# EAGLE design osZ_inv (EAGLE 5.10)
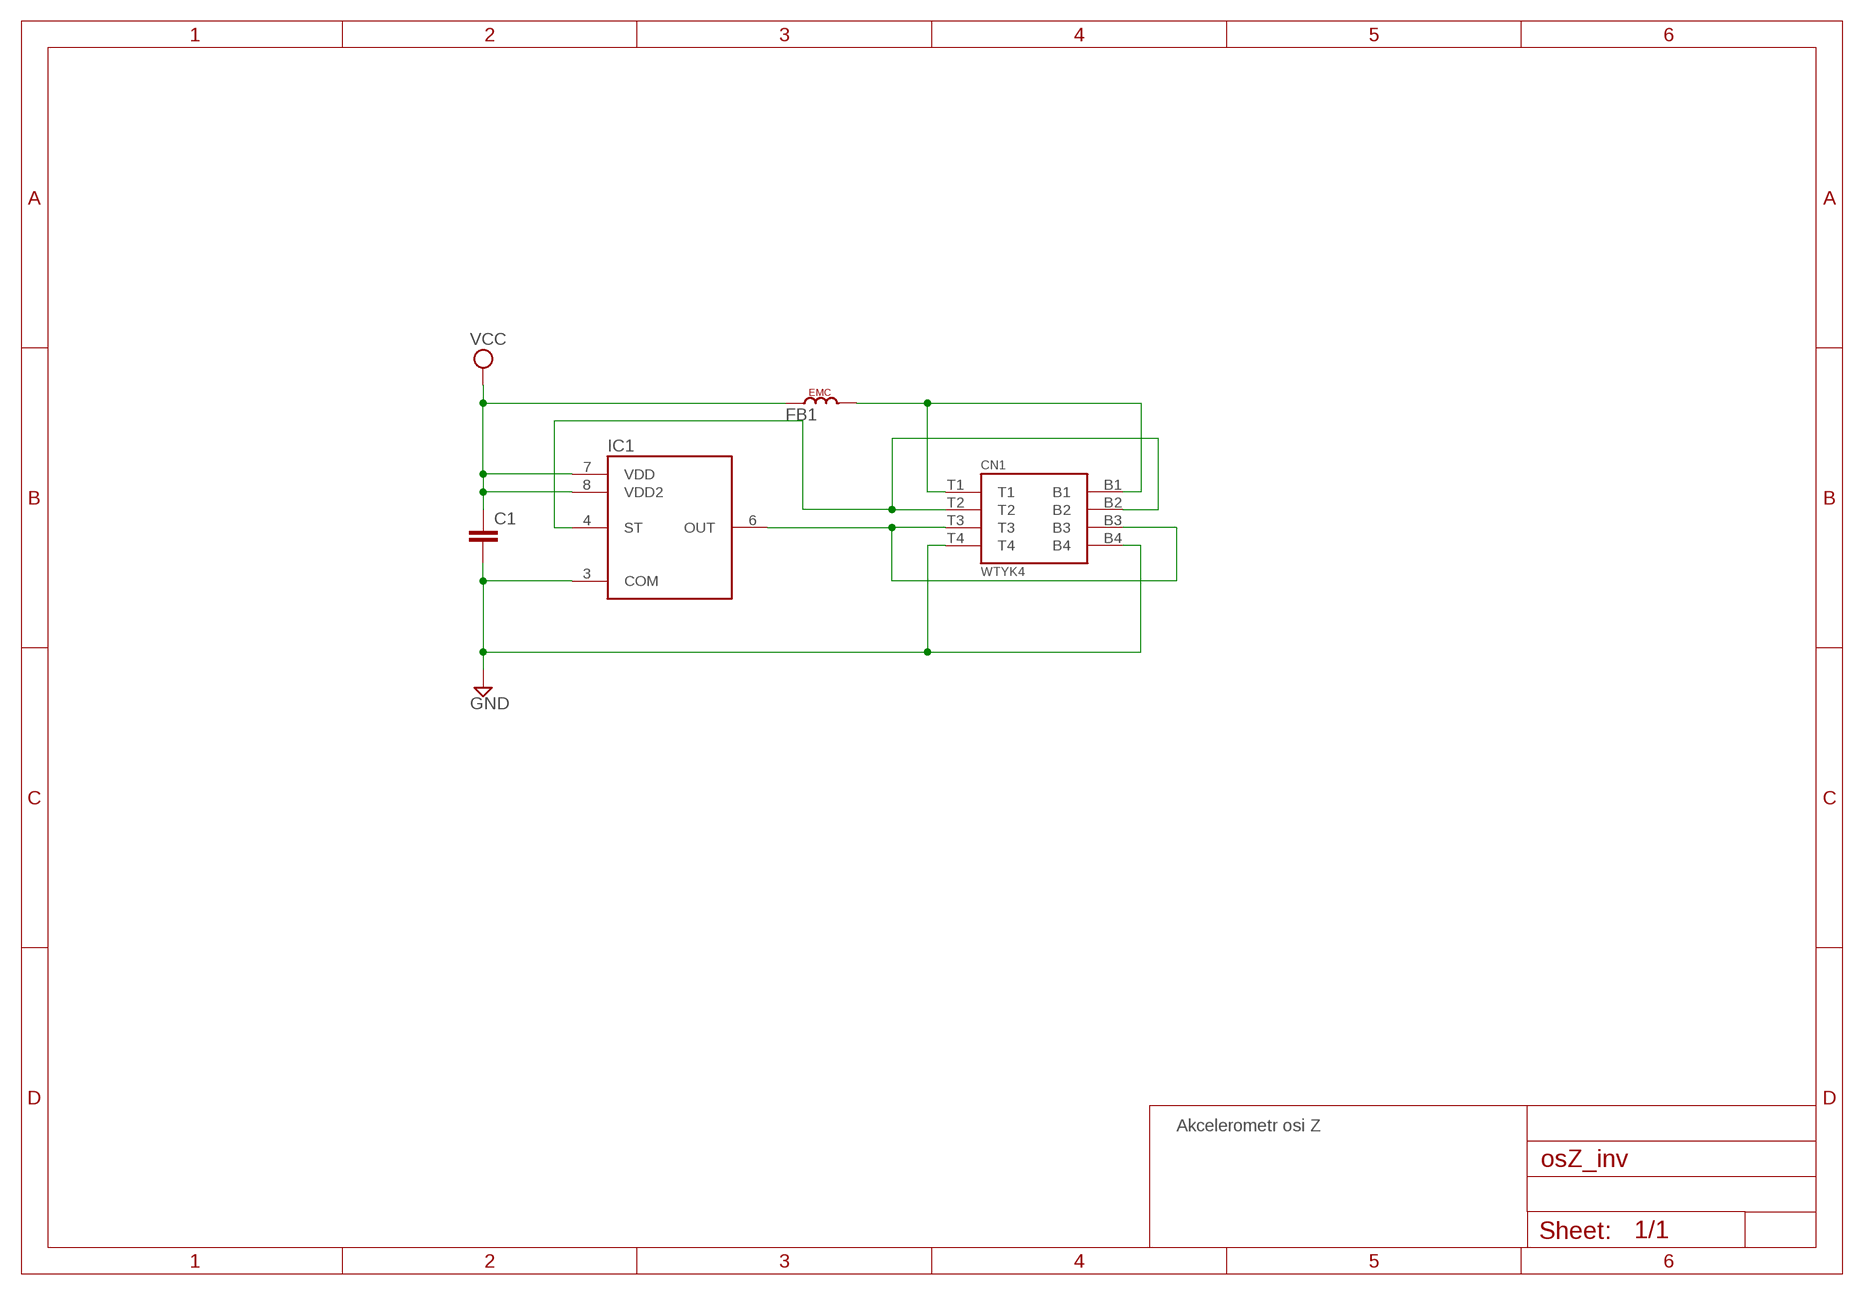
[diagram p0: schematic, sheet 1]

## Parts
C1  C-EUC0805K  [C0805K]
CN1  WTYK4  [WTYK]
FB1  FERRITE_BEAD0805  [R0805]
IC1  ADXL001-70L  [LCC8_LONG]

## Nets
GND: C1.2 CN1.B4 CN1.T4 IC1.3(COM)
N$1: CN1.B1 CN1.T1 FB1.2
N$6: CN1.B2 CN1.T2 IC1.4(ST)
N$8: CN1.B3 CN1.T3 IC1.6(OUT)
VCC: C1.1 FB1.1 IC1.7(VDD) IC1.8(VDD2)

## Notes on the sheet
- Akcelerometr osi Z

## Library data of the parts
C1 = rcl:C-EU: CAPACITOR, European symbol
CN1 = mechanika:WTYK4
FB1 = passives:FERRITE_BEAD
IC1 = lib1:ADXL001

## Board
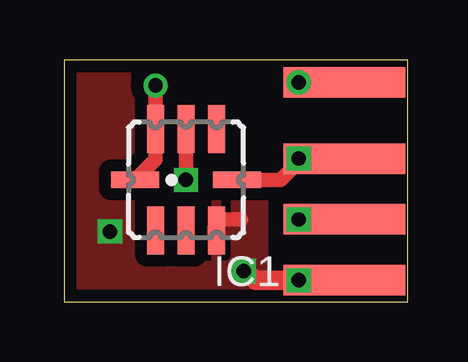
[diagram p1: board, top side]
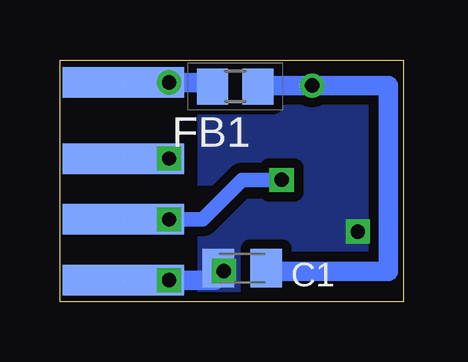
[diagram p2: board, bottom side, seen from below]

Size 14.33 x 10.08 mm. Coordinates in mm from the lower left corner, seen from the top.
Outline: 0,0 14.33,0 14.33,10.08 0,10.08 0,0
Copper layers (1*16): Top 0.035mm / dielectric 1.5mm / Bottom 0.035mm
Design rules "drukowane.pl *": minimum track width 8mil, minimum drill 16mil, track to track 8mil, track to pad 8mil, pad to pad 8mil, via to via 8mil, smd to smd 8mil, copper to edge 16mil, drill to drill 8mil, minimum pad ring 10mil, minimum via ring 8mil, stop-mask expansion 4mil, vias tented up to drill 0mil, thermal gap 10mil
tRestrict: area 9,-0.3 to 14.4,9.5
bRestrict: area 9,-0.1 to 14.4,9.5

### Footprints (pad centres in the part's own frame; a part is rotated, then mirrored left to right if it is on the bottom)
C0805K = smd 1.3 x 1.6: 1 -1,0; 2 1,0
WTYK = smd 5.08 x 1.27 bottom: B1 0,4.445; B2 0,1.27; B3 0,-1.27; B4 0,-3.81 | smd 5.08 x 1.27: T1 0,4.445; T2 0,1.27; T3 0,-1.27; T4 0,-3.81
R0805 = smd 1.3 x 1.5: 1 -0.95,0; 2 0.95,0
LCC8_LONG = smd 2 x 0.7: 1 -2.121,1.27; 2 -2.121,0; 3 -2.121,-1.27; 5 2.121,-1.27; 6 2.121,0; 7 2.121,1.27 | smd 0.7 x 2: 4 0,-2.121; 8 0,2.121

### Placement (x,y rotation side)
C1  6.73,1.4 180 bottom
CN1  11.68,4.7 0 top
FB1  7.02,8.98 180 bottom
IC1  5.08,5.08 90 top

### Tracks (layer width: path | path; a pad name or v marks a point on that pad's centre or on a via)
GND  (via drill 0.6)  (1 unrouted)
  Top 0.61: 6.6,3.43 7.37,3.43
  Top 0.813: v9.78,0.89 8,0.89 v7.49,1.27
  Bottom 0.813: v9.78,0.89 CN1.T4 7.87,0.89 v7.49,1.27
  other vias: 1.91,2.92
  pour Top (isolate 0.508): -0.25,10.29 -0.76,-0.25 14.73,-0.64 14.73,9.78
  pour Bottom (isolate 0.406, no thermals): -0.38,10.29 14.48,10.03 14.48,-0.64 -0.38,-0.38
N$1  (via drill 0.6)  (1 unrouted)
  Bottom 0.813: FB1.2 8.14,9.14 v9.78,9.14 CN1.T1
N$2  (via drill 0.6)
  other vias: 9.78,3.43
N$3  (via drill 0.6)
  other vias: 9.78,5.97
N$6  (1 unrouted)
  Top 0.61: IC1.4 9.02,5.08 9.91,5.97 CN1.B2
N$8  (via drill 0.6)  (1 unrouted)
  Top 0.61: IC1.6 v5.08,5.08
  Bottom 0.61: CN1.T3 8.38,3.43 6.73,5.08 v5.08,5.08
VCC  (via drill 0.6)
  Top 0.61: IC1.8 3.81,5.93 IC1.7 v3.81,9.02
  Bottom 0.61: 5.71,1.27 5.73,1.29 C1.1
  Bottom 0.813: FB1.1 6.1,9.02 v3.81,9.02 0.64,9.02 0.64,1.27 5.71,1.27